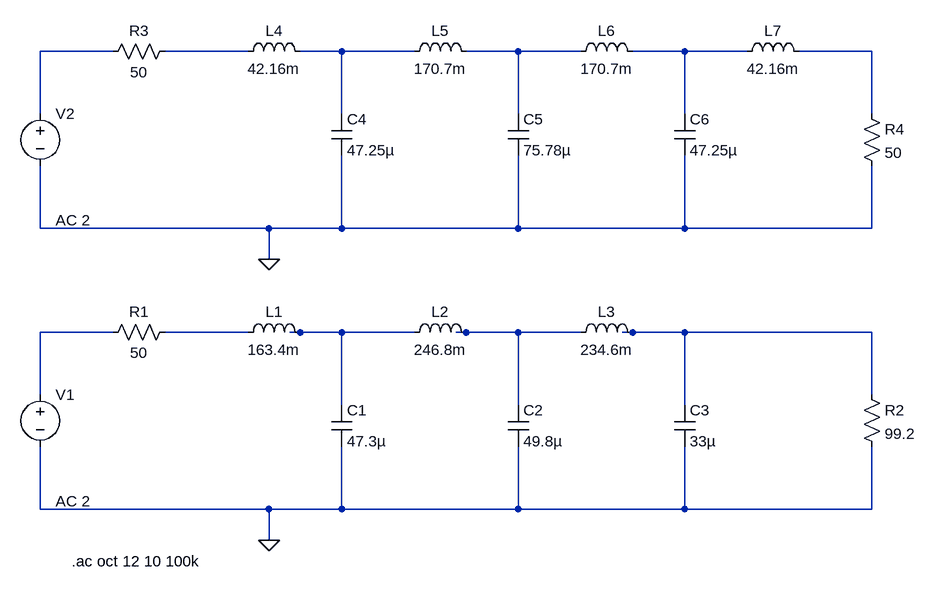
[diagram p0: schematic Draft3 Cherbyshev.asc]
Draft3 Cherbyshev.asc, the LTspice schematic file:
Version 4.1
SHEET 1 1976 784
WIRE 240 -432 128 -432
WIRE 448 -432 320 -432
WIRE 592 -432 528 -432
WIRE 704 -432 592 -432
WIRE 864 -432 784 -432
WIRE 960 -432 864 -432
WIRE 1120 -432 1040 -432
WIRE 1216 -432 1120 -432
WIRE 1408 -432 1296 -432
WIRE 128 -336 128 -432
WIRE 592 -336 592 -432
WIRE 864 -336 864 -432
WIRE 1120 -336 1120 -432
WIRE 1408 -336 1408 -432
WIRE 128 -160 128 -256
WIRE 480 -160 128 -160
WIRE 592 -160 592 -272
WIRE 592 -160 480 -160
WIRE 864 -160 864 -272
WIRE 864 -160 592 -160
WIRE 1120 -160 1120 -272
WIRE 1120 -160 864 -160
WIRE 1408 -160 1408 -256
WIRE 1408 -160 1120 -160
WIRE 480 -112 480 -160
WIRE 240 0 128 0
WIRE 448 0 320 0
WIRE 528 0 512 0
WIRE 592 0 528 0
WIRE 704 0 592 0
WIRE 784 0 768 0
WIRE 864 0 784 0
WIRE 960 0 864 0
WIRE 1040 0 1024 0
WIRE 1120 0 1040 0
WIRE 1408 0 1120 0
WIRE 128 96 128 0
WIRE 1408 96 1408 0
WIRE 592 112 592 0
WIRE 864 112 864 0
WIRE 1120 112 1120 0
WIRE 128 272 128 176
WIRE 480 272 128 272
WIRE 592 272 592 176
WIRE 592 272 480 272
WIRE 864 272 864 176
WIRE 864 272 592 272
WIRE 1120 272 1120 176
WIRE 1120 272 864 272
WIRE 1408 272 1408 176
WIRE 1408 272 1120 272
WIRE 480 320 480 272
FLAG 480 320 0
FLAG 480 -112 0
SYMBOL voltage 128 80 R0
WINDOW 3 24 152 Left 2
WINDOW 123 24 180 Left 2
WINDOW 39 0 0 Left 0
SYMATTR Value ""
SYMATTR Value2 AC 2
SYMATTR InstName V1
SYMBOL res 336 -16 R90
WINDOW 0 0 56 VBottom 2
WINDOW 3 32 56 VTop 2
SYMATTR InstName R1
SYMATTR Value 50
SYMBOL res 1392 80 R0
SYMATTR InstName R2
SYMATTR Value 99.2
SYMBOL ind 432 16 R270
WINDOW 0 32 56 VTop 2
WINDOW 3 5 56 VBottom 2
SYMATTR InstName L1
SYMATTR Value 163.4m
SYMBOL ind 688 16 R270
WINDOW 0 32 56 VTop 2
WINDOW 3 5 56 VBottom 2
SYMATTR InstName L2
SYMATTR Value 246.8m
SYMBOL ind 944 16 R270
WINDOW 0 32 56 VTop 2
WINDOW 3 5 56 VBottom 2
SYMATTR InstName L3
SYMATTR Value 234.6m
SYMBOL cap 576 112 R0
SYMATTR InstName C1
SYMATTR Value 47.3µ
SYMBOL cap 848 112 R0
SYMATTR InstName C2
SYMATTR Value 49.8µ
SYMBOL cap 1104 112 R0
SYMATTR InstName C3
SYMATTR Value 33µ
SYMBOL voltage 128 -352 R0
WINDOW 3 24 152 Left 2
WINDOW 123 24 180 Left 2
WINDOW 39 0 0 Left 0
SYMATTR Value ""
SYMATTR Value2 AC 2
SYMATTR InstName V2
SYMBOL res 336 -448 R90
WINDOW 0 0 56 VBottom 2
WINDOW 3 32 56 VTop 2
SYMATTR InstName R3
SYMATTR Value 50
SYMBOL res 1392 -352 R0
SYMATTR InstName R4
SYMATTR Value 50
SYMBOL ind 432 -416 R270
WINDOW 0 32 56 VTop 2
WINDOW 3 5 56 VBottom 2
SYMATTR InstName L4
SYMATTR Value 42.16m
SYMBOL ind 688 -416 R270
WINDOW 0 32 56 VTop 2
WINDOW 3 5 56 VBottom 2
SYMATTR InstName L5
SYMATTR Value 170.7m
SYMBOL ind 944 -416 R270
WINDOW 0 32 56 VTop 2
WINDOW 3 5 56 VBottom 2
SYMATTR InstName L6
SYMATTR Value 170.7m
SYMBOL ind 1200 -416 R270
WINDOW 0 32 56 VTop 2
WINDOW 3 5 56 VBottom 2
SYMATTR InstName L7
SYMATTR Value 42.16m
SYMBOL cap 576 -336 R0
SYMATTR InstName C4
SYMATTR Value 47.25µ
SYMBOL cap 848 -336 R0
SYMATTR InstName C5
SYMATTR Value 75.78µ
SYMBOL cap 1104 -336 R0
SYMATTR InstName C6
SYMATTR Value 47.25µ
TEXT 176 352 Left 2 !.ac oct 12 10 100k

The netlist it stands for:
* Draft3 Cherbyshev.asc
V1 N007 0 AC 2
R1 N008 N007 50
R2 N011 0 99.2
L1 N008 N009 163.4m
L2 N009 N010 246.8m
L3 N010 N011 234.6m
C1 N009 0 47.3µ
C2 N010 0 49.8µ
C3 N011 0 33µ
V2 N001 0 AC 2
R3 N002 N001 50
R4 N006 0 50
L4 N002 N003 42.16m
L5 N003 N004 170.7m
L6 N004 N005 170.7m
L7 N005 N006 42.16m
C4 N003 0 47.25µ
C5 N004 0 75.78µ
C6 N005 0 47.25µ
.ac oct 12 10 100k
.backanno
.end